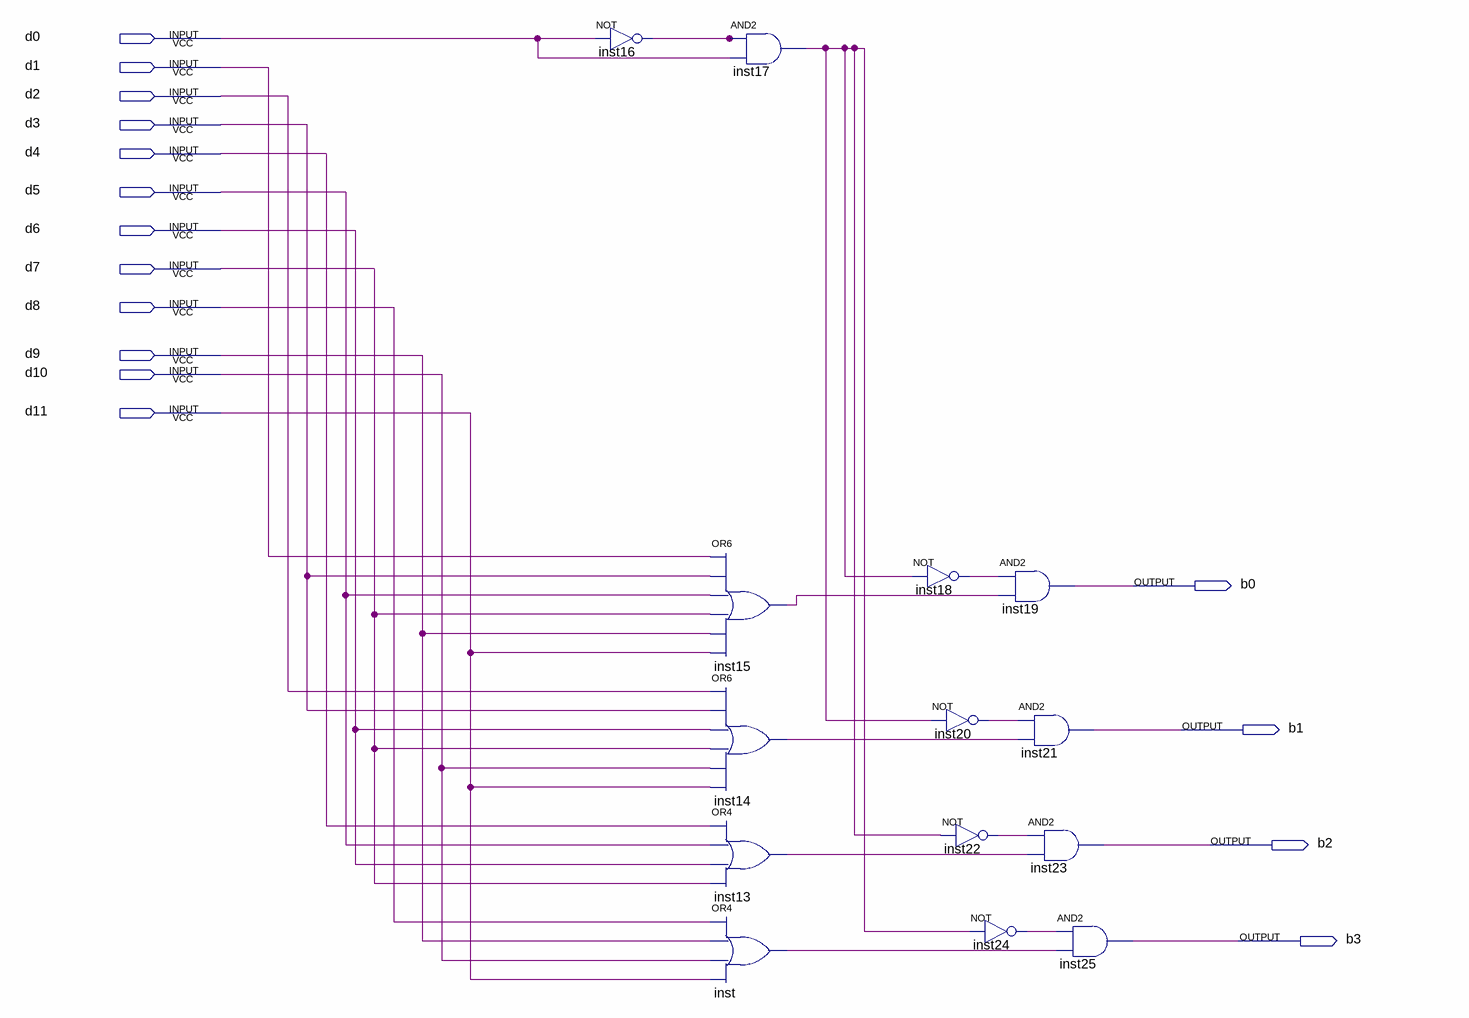
[diagram p0: schematic sheet]
// Quartus schematic week2_2.bdf as structural Verilog: 14 symbols, 16 pins
module week2_2 (
  input  d0,
  input  d1,
  input  d2,
  input  d3,
  input  d4,
  input  d5,
  input  d6,
  input  d7,
  input  d8,
  input  d9,
  input  d10,
  input  d11,
  output b0,
  output b1,
  output b2,
  output b3
);

  wire inst13_out, inst14_out, inst15_out, inst16_out, inst17_out, inst18_out, inst20_out, inst22_out,
       inst24_out, inst_out;

  not inst16 (inst16_out, d0);
  and inst17 (inst17_out, inst16_out, d0);
  or inst15 (inst15_out, d1, d3, d5, d7, d9, d11);
  or inst14 (inst14_out, d2, d3, d6, d7, d10, d11);
  or inst13 (inst13_out, d4, d5, d6, d7);
  or inst (inst_out, d8, d9, d10, d11);
  not inst18 (inst18_out, inst17_out);
  not inst20 (inst20_out, inst17_out);
  not inst22 (inst22_out, inst17_out);
  not inst24 (inst24_out, inst17_out);
  and inst19 (b0, inst18_out, inst15_out);
  and inst21 (b1, inst20_out, inst14_out);
  and inst23 (b2, inst22_out, inst13_out);
  and inst25 (b3, inst24_out, inst_out);
endmodule
